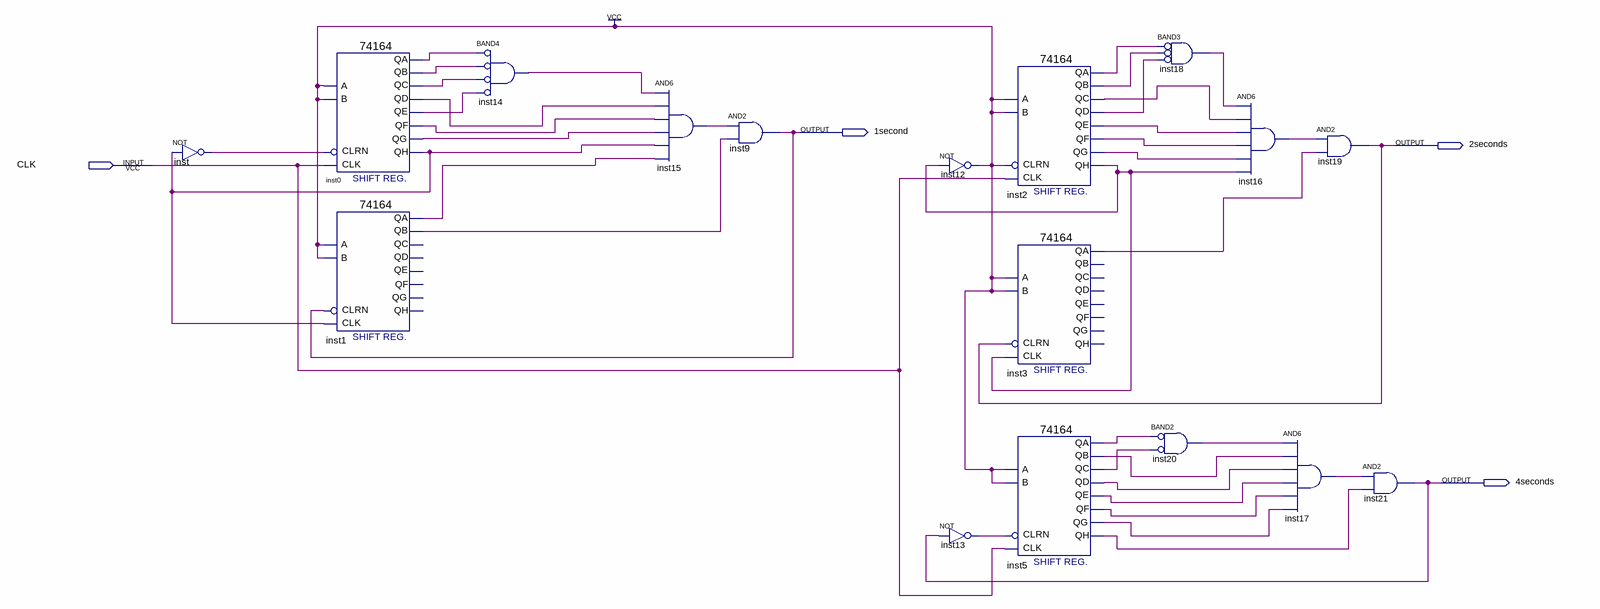
[diagram p0: schematic sheet]
// Quartus schematic Clocks124.bdf as structural Verilog: 17 symbols, 4 pins
module Clocks124 (
  input  CLK,
  output \1second ,
  output \2seconds ,
  output \4seconds 
);

  wire inst0_qa, inst0_qb, inst0_qc, inst0_qd, inst0_qe, inst0_qf, inst0_qg, inst0_qh, inst1_qa, inst1_qb,
       inst2_qa, inst2_qb, inst2_qc, inst2_qd, inst2_qe, inst2_qf, inst2_qg, inst2_qh, inst3_qa, inst5_qa,
       inst5_qb, inst5_qc, inst5_qd, inst5_qe, inst5_qf, inst5_qg, inst5_qh, inst12_out, inst13_out,
       inst14_out, inst15_out, inst16_out, inst17_out, inst18_out, inst20_out, inst_out;

  not inst (inst_out, inst0_qh);
  \74164  inst0 (
    .CLRN(inst_out), .CLK(CLK), .B(inst12_out), .A(inst12_out), .QD(inst0_qd), .QC(inst0_qc), .QA(inst0_qa),
    .QF(inst0_qf), .QH(inst0_qh), .QG(inst0_qg), .QE(inst0_qe), .QB(inst0_qb));
  \74164  inst1 (
    .CLRN(\1second ), .CLK(inst0_qh), .B(inst12_out), .A(inst12_out), .QA(inst1_qa), .QB(inst1_qb));  // open: QD, QC, QF, QH, QG, QE
  and inst14 (inst14_out, ~inst0_qa, ~inst0_qb, ~inst0_qc, ~inst0_qe);  // BAND4
  and inst15 (inst15_out, inst14_out, inst0_qd, inst0_qf, inst0_qg, inst0_qh, inst1_qa);
  and inst9 (\1second , inst15_out, inst1_qb);
  not inst12 (inst12_out, inst2_qh);
  not inst13 (inst13_out, \4seconds );
  \74164  inst2 (
    .CLRN(inst12_out), .CLK(CLK), .B(inst12_out), .A(inst12_out), .QD(inst2_qd), .QC(inst2_qc),
    .QA(inst2_qa), .QF(inst2_qf), .QH(inst2_qh), .QG(inst2_qg), .QE(inst2_qe), .QB(inst2_qb));
  \74164  inst3 (
    .CLRN(\2seconds ), .CLK(inst2_qh), .B(inst12_out), .A(inst12_out), .QA(inst3_qa));  // open: QD, QC, QF, QH, QG, QE, QB
  \74164  inst5 (
    .CLRN(inst13_out), .CLK(CLK), .B(inst12_out), .A(inst12_out), .QD(inst5_qd), .QC(inst5_qc),
    .QA(inst5_qa), .QF(inst5_qf), .QH(inst5_qh), .QG(inst5_qg), .QE(inst5_qe), .QB(inst5_qb));
  and inst18 (inst18_out, ~inst2_qa, ~inst2_qb, ~inst2_qd);  // BAND3
  and inst20 (inst20_out, ~inst5_qa, ~inst5_qc);  // BAND2
  and inst16 (inst16_out, inst18_out, inst2_qc, inst2_qe, inst2_qf, inst2_qg, inst2_qh);
  and inst17 (inst17_out, inst20_out, inst5_qb, inst5_qd, inst5_qe, inst5_qf, inst5_qg);
  and inst19 (\2seconds , inst16_out, inst3_qa);
  and inst21 (\4seconds , inst17_out, inst5_qh);
  // also tied to VCC on the sheet: inst12_out
endmodule
